# EAGLE schematic 0119-m328p (EAGLE 9.6.2)
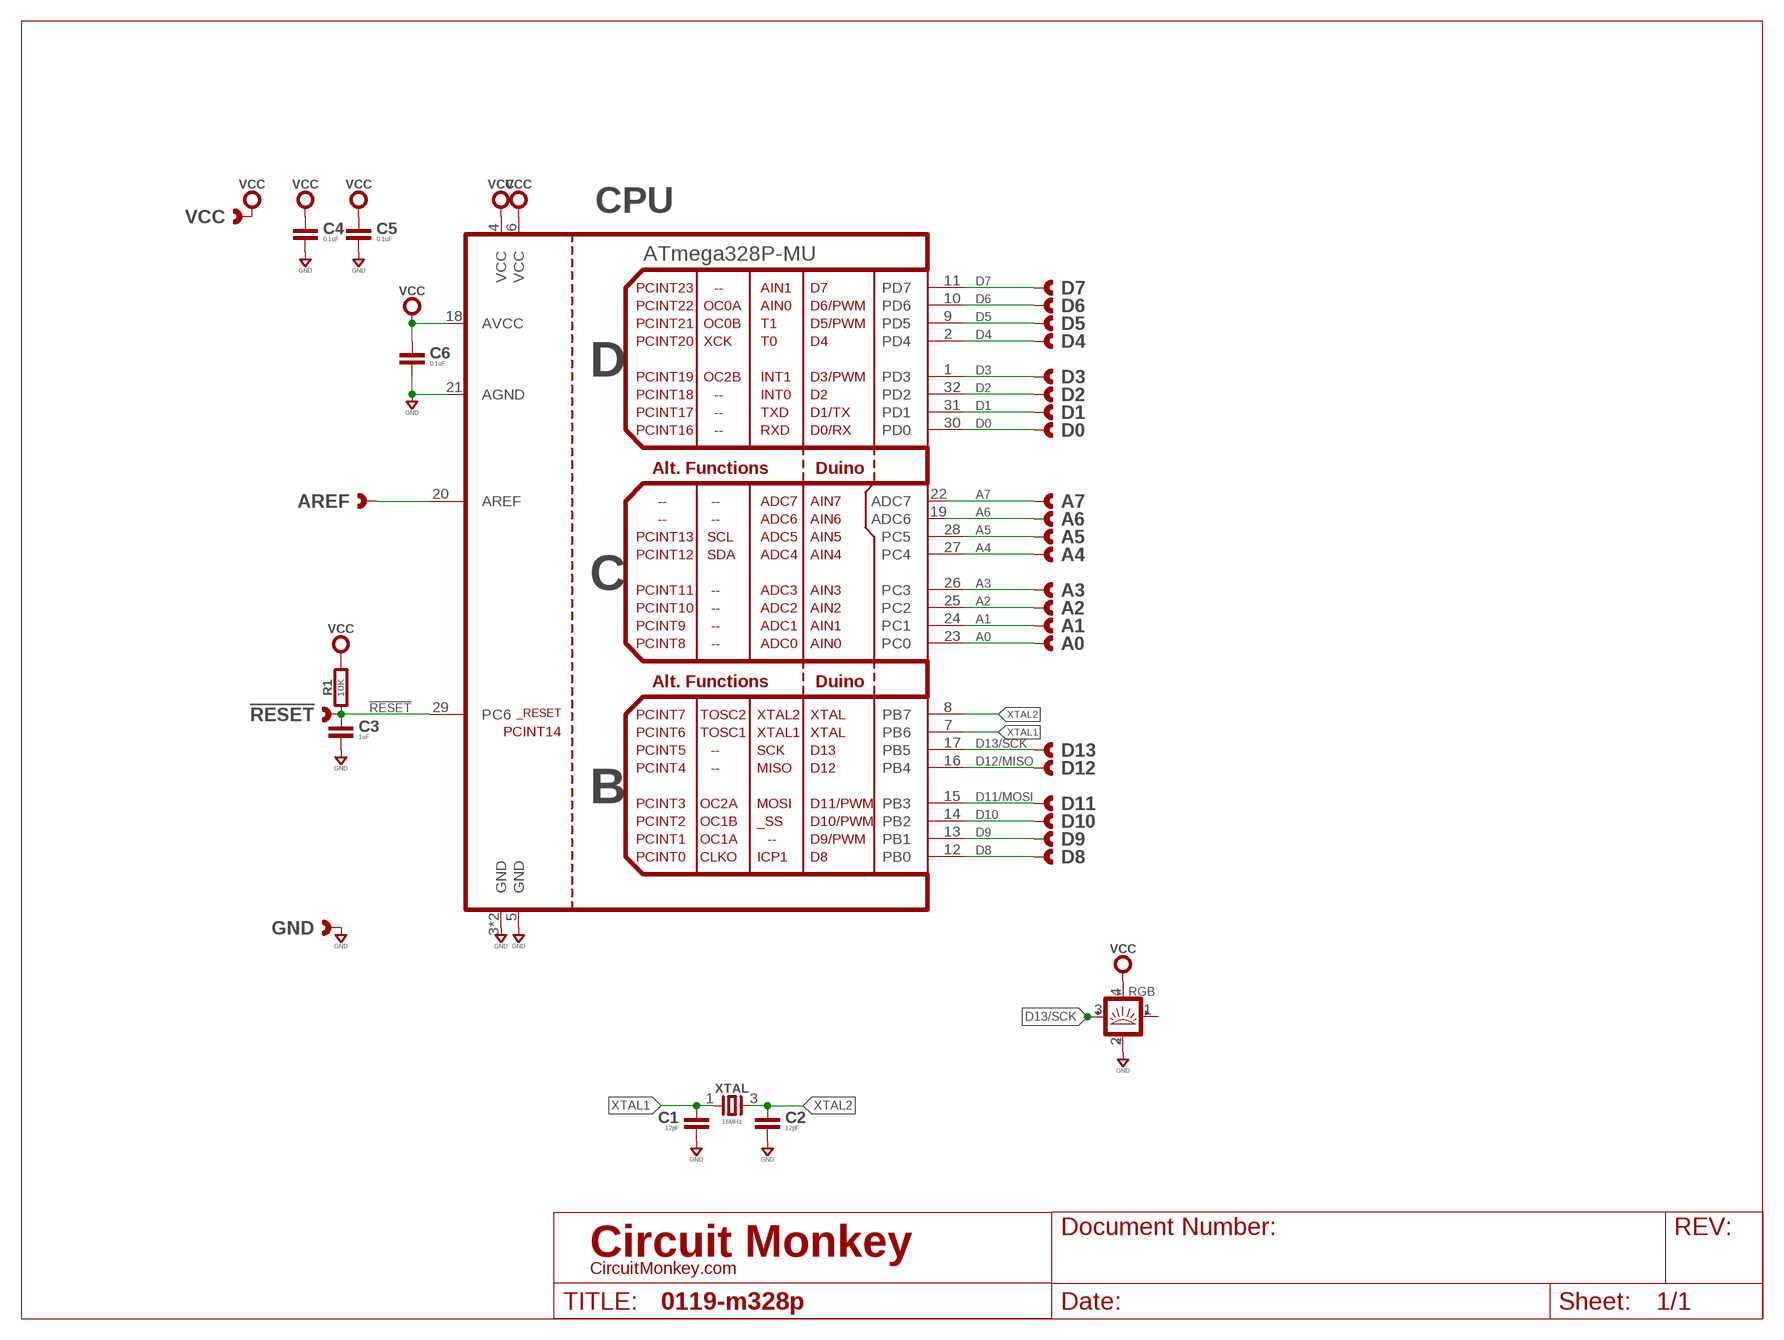
[diagram p0: schematic, sheet 1]

## Parts
!RESET  CAST-01X12.00MM  [CAST01-2.00MM]
A0  CAST-01X12.00MM  [CAST01-2.00MM]
A1  CAST-01X12.00MM  [CAST01-2.00MM]
A2  CAST-01X12.00MM  [CAST01-2.00MM]
A3  CAST-01X12.00MM  [CAST01-2.00MM]
A4  CAST-01X12.00MM  [CAST01-2.00MM]
A5  CAST-01X12.00MM  [CAST01-2.00MM]
A6  CAST-01X12.00MM  [CAST01-2.00MM]
A7  CAST-01X12.00MM  [CAST01-2.00MM]
AREF  CAST-01X12.00MM  [CAST01-2.00MM]
C1  12pF  CAPACITOR0402  [0402-CAP]
C2  12pF  CAPACITOR0402  [0402-CAP]
C3  1uF  CAPACITOR0402  [0402-CAP]
C4  0.1uF  CAPACITOR0402  [0402-CAP]
C5  0.1uF  CAPACITOR0402  [0402-CAP]
C6  0.1uF  CAPACITOR0402  [0402-CAP]
CPU  ATmega328P-MU  ATMEGA328MU  [MLF32]
D0  CAST-01X12.00MM  [CAST01-2.00MM]
D1  CAST-01X12.00MM  [CAST01-2.00MM]
D2  CAST-01X12.00MM  [CAST01-2.00MM]
D3  CAST-01X12.00MM  [CAST01-2.00MM]
D4  CAST-01X12.00MM  [CAST01-2.00MM]
D5  CAST-01X12.00MM  [CAST01-2.00MM]
D6  CAST-01X12.00MM  [CAST01-2.00MM]
D7  CAST-01X12.00MM  [CAST01-2.00MM]
D8  CAST-01X12.00MM  [CAST01-2.00MM]
D9  CAST-01X12.00MM  [CAST01-2.00MM]
D10  CAST-01X12.00MM  [CAST01-2.00MM]
D11  CAST-01X12.00MM  [CAST01-2.00MM]
D12  CAST-01X12.00MM  [CAST01-2.00MM]
D13  CAST-01X12.00MM  [CAST01-2.00MM]
GND  CAST-01X12.00MM  [CAST01-2.00MM]
R1  10K  RESISTOR0402  [0402-RES]
RGB  SMART_LED2020  [SMD_2020]
VCC  CAST-01X12.00MM  [CAST01-2.00MM]
XTAL  16MHz  2P3.2X2.5  [32X25]

## Nets
!RESET: !RESET.1 !RESET.P$1 !RESET.P$2 C3.1 CPU.29(PC6) R1.1
A0: A0.1 A0.P$1 A0.P$2 CPU.23(PC0)
A1: A1.1 A1.P$1 A1.P$2 CPU.24(PC1)
A2: A2.1 A2.P$1 A2.P$2 CPU.25(PC2)
A3: A3.1 A3.P$1 A3.P$2 CPU.26(PC3)
A4: A4.1 A4.P$1 A4.P$2 CPU.27(PC4)
A5: A5.1 A5.P$1 A5.P$2 CPU.28(PC5)
A6: A6.1 A6.P$1 A6.P$2 CPU.19(ADC6)
A7: A7.1 A7.P$1 A7.P$2 CPU.22(ADC7)
D0: CPU.30(PD0) D0.1 D0.P$1 D0.P$2
D1: CPU.31(PD1) D1.1 D1.P$1 D1.P$2
D2: CPU.32(PD2) D2.1 D2.P$1 D2.P$2
D3: CPU.1(PD3) D3.1 D3.P$1 D3.P$2
D4: CPU.2(PD4) D4.1 D4.P$1 D4.P$2
D5: CPU.9(PD5) D5.1 D5.P$1 D5.P$2
D6: CPU.10(PD6) D6.1 D6.P$1 D6.P$2
D7: CPU.11(PD7) D7.1 D7.P$1 D7.P$2
D8: CPU.12(PB0) D8.1 D8.P$1 D8.P$2
D9: CPU.13(PB1) D9.1 D9.P$1 D9.P$2
D10: CPU.14(PB2) D10.1 D10.P$1 D10.P$2
D11/MOSI: CPU.15(PB3) D11.1 D11.P$1 D11.P$2
D12/MISO: CPU.16(PB4) D12.1 D12.P$1 D12.P$2
D13/SCK: CPU.17(PB5) D13.1 D13.P$1 D13.P$2 RGB.3(IN)
GND: C1.2 C2.2 C3.2 C4.2 C5.2 C6.2 CPU.3(GND) CPU.5(GND) CPU.21(AGND) CPU.PAD(GND) GND.1 GND.P$1 GND.P$2 RGB.2(GND)
N$2: AREF.1 AREF.P$1 AREF.P$2 CPU.20(AREF)
VCC: C4.1 C5.1 C6.1 CPU.4(VCC) CPU.6(VCC) CPU.18(AVCC) R1.2 RGB.4(VDD) VCC.1 VCC.P$1 VCC.P$2
XTAL1: C1.1 CPU.7(PB6) XTAL.1
XTAL2: C2.1 CPU.8(PB7) XTAL.3
Unconnected: RGB.1(OUT)

## Library data of the parts
!RESET A0 A1-A7 AREF D0 D1-D13 GND VCC = con-headers:CAST-01X1: Castelated Edge Hole Pad
C1-C6 = rlc:CAPACITOR: Capacitor
CPU = atmel-atmega:ATMEGA328: Atmega 328P; MFR: Atmel; MPN: atmega328p-mu; OC_MOUSER: 556-ATMEGA328P-MU; OC_SEEED: 310010005
R1 = rlc:RESISTOR: Resistor
RGB = led:SMART_LED: Smart LED SK6812 WS2812
XTAL = xtal:2P: Crystal; MF: Epson; MPN: FA-238 16.0000MB-K3